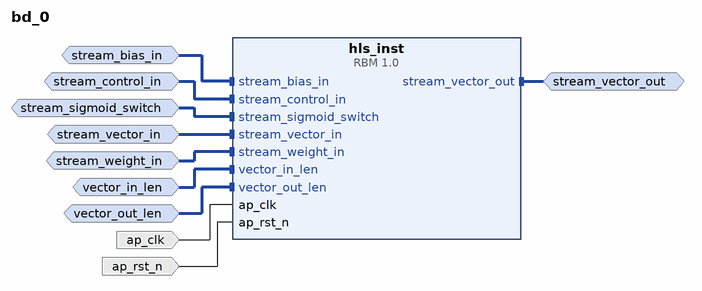
[diagram p0: block diagram of the top level]
# Vivado block design bd_0, xc7z020clg400-1, Vivado 2022.2
create_bd_design bd_0

create_bd_intf_port -mode Slave -vlnv xilinx.com:interface:axis_rtl:1.0 stream_bias_in
set_property -dict [list \
  CONFIG.FREQ_HZ 80000000.0 \
  CONFIG.HAS_TKEEP 0 \
  CONFIG.HAS_TLAST 0 \
  CONFIG.HAS_TREADY 1 \
  CONFIG.HAS_TSTRB 0 \
  CONFIG.LAYERED_METADATA undef \
  CONFIG.TDATA_NUM_BYTES 6 \
  CONFIG.TDEST_WIDTH 0 \
  CONFIG.TID_WIDTH 0 \
  CONFIG.TUSER_WIDTH 0 \
] [get_bd_intf_ports stream_bias_in]
create_bd_intf_port -mode Slave -vlnv xilinx.com:interface:axis_rtl:1.0 stream_control_in
set_property -dict [list \
  CONFIG.FREQ_HZ 80000000.0 \
  CONFIG.HAS_TKEEP 0 \
  CONFIG.HAS_TLAST 0 \
  CONFIG.HAS_TREADY 1 \
  CONFIG.HAS_TSTRB 0 \
  CONFIG.LAYERED_METADATA undef \
  CONFIG.TDATA_NUM_BYTES 1 \
  CONFIG.TDEST_WIDTH 0 \
  CONFIG.TID_WIDTH 0 \
  CONFIG.TUSER_WIDTH 0 \
] [get_bd_intf_ports stream_control_in]
create_bd_intf_port -mode Slave -vlnv xilinx.com:interface:axis_rtl:1.0 stream_sigmoid_switch
set_property -dict [list \
  CONFIG.FREQ_HZ 80000000.0 \
  CONFIG.HAS_TKEEP 0 \
  CONFIG.HAS_TLAST 0 \
  CONFIG.HAS_TREADY 1 \
  CONFIG.HAS_TSTRB 0 \
  CONFIG.LAYERED_METADATA undef \
  CONFIG.TDATA_NUM_BYTES 1 \
  CONFIG.TDEST_WIDTH 0 \
  CONFIG.TID_WIDTH 0 \
  CONFIG.TUSER_WIDTH 0 \
] [get_bd_intf_ports stream_sigmoid_switch]
create_bd_intf_port -mode Slave -vlnv xilinx.com:interface:axis_rtl:1.0 stream_vector_in
set_property -dict [list \
  CONFIG.FREQ_HZ 80000000.0 \
  CONFIG.HAS_TKEEP 0 \
  CONFIG.HAS_TLAST 0 \
  CONFIG.HAS_TREADY 1 \
  CONFIG.HAS_TSTRB 0 \
  CONFIG.LAYERED_METADATA undef \
  CONFIG.TDATA_NUM_BYTES 4 \
  CONFIG.TDEST_WIDTH 0 \
  CONFIG.TID_WIDTH 0 \
  CONFIG.TUSER_WIDTH 0 \
] [get_bd_intf_ports stream_vector_in]
create_bd_intf_port -mode Master -vlnv xilinx.com:interface:axis_rtl:1.0 stream_vector_out
set_property -dict {CONFIG.FREQ_HZ 80000000.0} [get_bd_intf_ports stream_vector_out]
create_bd_intf_port -mode Slave -vlnv xilinx.com:interface:axis_rtl:1.0 stream_weight_in
set_property -dict [list \
  CONFIG.FREQ_HZ 80000000.0 \
  CONFIG.HAS_TKEEP 0 \
  CONFIG.HAS_TLAST 0 \
  CONFIG.HAS_TREADY 1 \
  CONFIG.HAS_TSTRB 0 \
  CONFIG.LAYERED_METADATA undef \
  CONFIG.TDATA_NUM_BYTES 4 \
  CONFIG.TDEST_WIDTH 0 \
  CONFIG.TID_WIDTH 0 \
  CONFIG.TUSER_WIDTH 0 \
] [get_bd_intf_ports stream_weight_in]
create_bd_intf_port -mode Slave -vlnv xilinx.com:interface:axis_rtl:1.0 vector_in_len
set_property -dict [list \
  CONFIG.FREQ_HZ 80000000.0 \
  CONFIG.HAS_TKEEP 0 \
  CONFIG.HAS_TLAST 0 \
  CONFIG.HAS_TREADY 1 \
  CONFIG.HAS_TSTRB 0 \
  CONFIG.LAYERED_METADATA undef \
  CONFIG.TDATA_NUM_BYTES 2 \
  CONFIG.TDEST_WIDTH 0 \
  CONFIG.TID_WIDTH 0 \
  CONFIG.TUSER_WIDTH 0 \
] [get_bd_intf_ports vector_in_len]
create_bd_intf_port -mode Slave -vlnv xilinx.com:interface:axis_rtl:1.0 vector_out_len
set_property -dict [list \
  CONFIG.FREQ_HZ 80000000.0 \
  CONFIG.HAS_TKEEP 0 \
  CONFIG.HAS_TLAST 0 \
  CONFIG.HAS_TREADY 1 \
  CONFIG.HAS_TSTRB 0 \
  CONFIG.LAYERED_METADATA undef \
  CONFIG.TDATA_NUM_BYTES 2 \
  CONFIG.TDEST_WIDTH 0 \
  CONFIG.TID_WIDTH 0 \
  CONFIG.TUSER_WIDTH 0 \
] [get_bd_intf_ports vector_out_len]
create_bd_port -dir I -type clk ap_clk
set_property -dict {CONFIG.FREQ_HZ 80000000.0} [get_bd_ports ap_clk]
create_bd_port -dir I -type rst ap_rst_n

create_bd_cell -type ip -vlnv xilinx.com:hls:RBM:1.0 hls_inst

# ---- connections ----

connect_bd_intf_net [get_bd_intf_ports stream_vector_out] [get_bd_intf_pins hls_inst/stream_vector_out]
connect_bd_intf_net -intf_net stream_bias_in_0_1 [get_bd_intf_ports stream_bias_in] [get_bd_intf_pins hls_inst/stream_bias_in]
connect_bd_intf_net -intf_net stream_control_in_0_1 [get_bd_intf_ports stream_control_in] [get_bd_intf_pins hls_inst/stream_control_in]
connect_bd_intf_net -intf_net stream_sigmoid_switch_0_1 [get_bd_intf_ports stream_sigmoid_switch] [get_bd_intf_pins hls_inst/stream_sigmoid_switch]
connect_bd_intf_net -intf_net stream_vector_in_0_1 [get_bd_intf_ports stream_vector_in] [get_bd_intf_pins hls_inst/stream_vector_in]
connect_bd_intf_net -intf_net stream_weight_in_0_1 [get_bd_intf_ports stream_weight_in] [get_bd_intf_pins hls_inst/stream_weight_in]
connect_bd_intf_net -intf_net vector_in_len_0_1 [get_bd_intf_ports vector_in_len] [get_bd_intf_pins hls_inst/vector_in_len]
connect_bd_intf_net -intf_net vector_out_len_0_1 [get_bd_intf_ports vector_out_len] [get_bd_intf_pins hls_inst/vector_out_len]
connect_bd_net -net ap_clk_0_1 [get_bd_ports ap_clk] [get_bd_pins hls_inst/ap_clk]
connect_bd_net -net ap_rst_n_0_1 [get_bd_ports ap_rst_n] [get_bd_pins hls_inst/ap_rst_n]

validate_bd_design
save_bd_design
